# Altium project S7CAS-PLEIADES-CARTE-MERE_Pxx.PrjPcb (part 4 of 5)

## Sheet S7CAS-PLEIADES-CARTE-MERE_Pxx_ARBRE_ALIMENTATION.SchDoc
size Tabloid; SheetNumber: 15; SheetTotal: 18; Sheet_Name: Insert name in Document Parameters; Size: 11x17
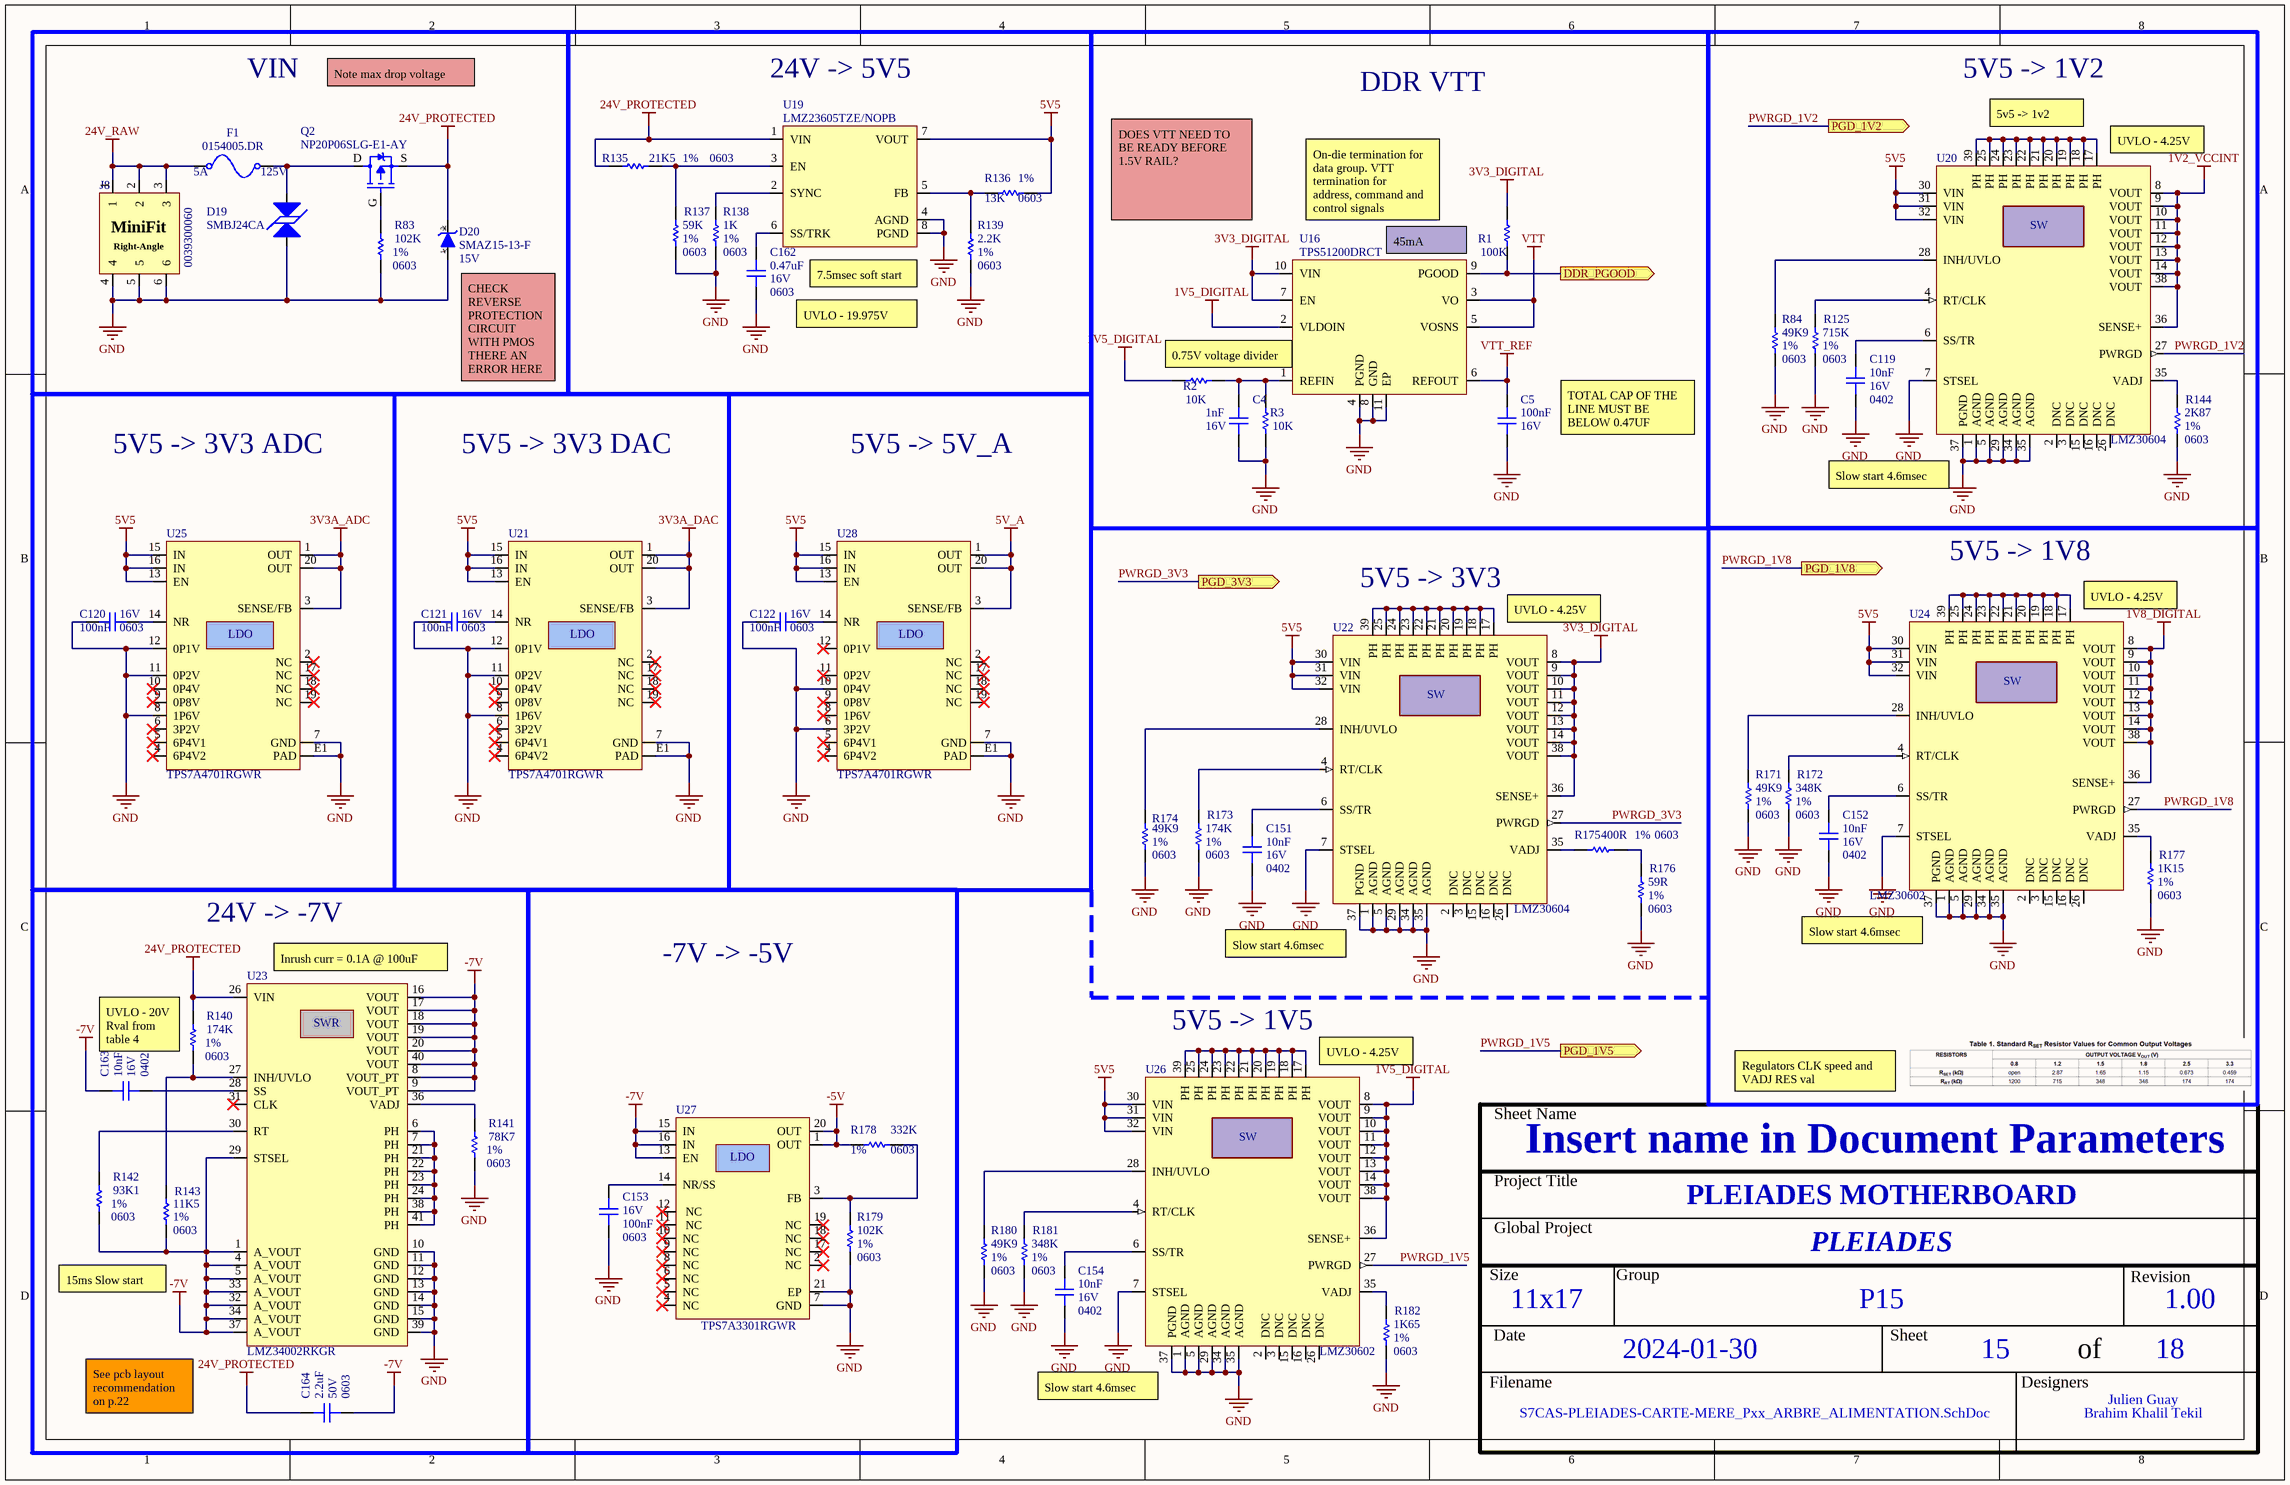
[diagram p13: S7CAS-PLEIADES-CARTE-MERE_Pxx_ARBRE_ALIMENTATION.SchDoc]

### Parts
C4  value 1nF  Voltage: 16V  [CAP_0603]  (hidden comment: CAP - 0603)
C5  value 100nF  Voltage: 16V  [CAP_0603]  (hidden comment: CAP - 0603)
C119  value 10nF  Voltage: 16V  Package: 0402  [CAP_0402]  (hidden comment: CAP - 0402)
C120  value 100nF  Voltage: 16V  Package: 0603  [CAP_0603]  (hidden comment: CAP - 0603)
C121  value 100nF  Voltage: 16V  Package: 0603  [CAP_0603]  (hidden comment: CAP - 0603)
C122  value 100nF  Voltage: 16V  Package: 0603  [CAP_0603]  (hidden comment: CAP - 0603)
C151  value 10nF  Voltage: 16V  Package: 0402  [CAP_0402]  (hidden comment: CAP - 0402)
C152  value 10nF  Voltage: 16V  Package: 0402  [CAP_0402]  (hidden comment: CAP - 0402)
C153  value 100nF  Voltage: 16V  Package: 0603  [CAP_0603]  (hidden comment: CAP - 0603)
C154  value 10nF  Voltage: 16V  Package: 0402  [CAP_0402]  (hidden comment: CAP - 0402)
C162  value 0.47uF  Voltage: 16V  Package: 0603  [CAP_0603]  (hidden comment: CAP - 0603)
C163  value 10nF  Voltage: 16V  Package: 0402  [CAP_0402]  (hidden comment: CAP - 0402)
C164  value 2.2uF  Voltage: 50V  Package: 0603  [CAP_0603]  (hidden comment: CAP - 0603)
D19  SMBJ24CA  [TVS_PWR_SMBJ36CA]
D20  SMAZ15-13-F  Reverse Voltage: 15V  [SMA]
F1  0154005.DR  Voltage Rating: 125V  Current Rating: 5A  [FUS_0154XXX.DR]
J8  0039300060  [CON_MINIFIT_0039300060]
Q2  NP20P06SLG-E1-AY  [TO-252]
R1  100K  [RES_0603]
R2  value 10K  [RES_0603]  (hidden comment: RES - 0603)
R3  value 10K  [RES_0603]  (hidden comment: RES - 0603)
R83  value 102K  Package: 0603  Precision: 1%  [RES_0603]  (hidden comment: RES - 0603)
R84  value 49K9  Package: 0603  Precision: 1%  [RES_0603]  (hidden comment: RES - 0603)
R125  value 715K  Package: 0603  Precision: 1%  [RES_0603]  (hidden comment: RES - 0603)
R135  value 21K5  Package: 0603  Precision: 1%  [RES_0603]  (hidden comment: RES - 0603)
R136  value 13K  Package: 0603  Precision: 1%  [RES_0603]  (hidden comment: RES - 0603)
R137  value 59K  Package: 0603  Precision: 1%  [RES_0603]  (hidden comment: RES - 0603)
R138  value 1K  Package: 0603  Precision: 1%  [RES_0603]  (hidden comment: RES - 0603)
R139  value 2.2K  Package: 0603  Precision: 1%  [RES_0603]  (hidden comment: RES - 0603)
R140  value 174K  Package: 0603  Precision: 1%  [RES_0603]  (hidden comment: RES - 0603)
R141  value 78K7  Package: 0603  Precision: 1%  [RES_0603]  (hidden comment: RES - 0603)
R142  value 93K1  Package: 0603  Precision: 1%  [RES_0603]  (hidden comment: RES - 0603)
R143  value 11K5  Package: 0603  Precision: 1%  [RES_0603]  (hidden comment: RES - 0603)
R144  value 2K87  Package: 0603  Precision: 1%  [RES_0603]  (hidden comment: RES - 0603)
R171  value 49K9  Package: 0603  Precision: 1%  [RES_0603]  (hidden comment: RES - 0603)
R172  value 348K  Package: 0603  Precision: 1%  [RES_0603]  (hidden comment: RES - 0603)
R173  value 174K  Package: 0603  Precision: 1%  [RES_0603]  (hidden comment: RES - 0603)
R174  value 49K9  Package: 0603  Precision: 1%  [RES_0603]  (hidden comment: RES - 0603)
R175  value 400R  Package: 0603  Precision: 1%  [RES_0603]  (hidden comment: RES - 0603)
R176  value 59R  Package: 0603  Precision: 1%  [RES_0603]  (hidden comment: RES - 0603)
R177  value 1K15  Package: 0603  Precision: 1%  [RES_0603]  (hidden comment: RES - 0603)
R178  value 332K  Package: 0603  Precision: 1%  [RES_0603]  (hidden comment: RES - 0603)
R179  value 102K  Package: 0603  Precision: 1%  [RES_0603]  (hidden comment: RES - 0603)
R180  value 49K9  Package: 0603  Precision: 1%  [RES_0603]  (hidden comment: RES - 0603)
R181  value 348K  Package: 0603  Precision: 1%  [RES_0603]  (hidden comment: RES - 0603)
R182  value 1K65  Package: 0603  Precision: 1%  [RES_0603]  (hidden comment: RES - 0603)
U16  TPS51200DRCT  [REG_PMIC_TPS51200DRCT]
U19  LMZ23605TZE/NOPB  [REG_SWR_LMZ23605TZE/NOPB]
U20  LMZ30604  [REG_SWI_LMZ30604]
U21  TPS7A4701RGWR  [REG_TPS7A4701RGWR]
U22  LMZ30604  [REG_SWI_LMZ30604]
U23  LMZ34002RKGR  [REG_SWR_LMZ34002RKGR]
U24  LMZ30602  [REG_SWI_LMZ30602]
U25  TPS7A4701RGWR  [REG_TPS7A4701RGWR]
U26  LMZ30602  [REG_SWI_LMZ30602]
U27  TPS7A3301RGWR  [REG_LDO_TPS7A3301RGWR]
U28  TPS7A4701RGWR  [REG_TPS7A4701RGWR]

### Blocks framed on the sheet
VIN: D19 D20 F1 J8 Q2 R83
24V -> 5V5: C162 R135-R139 U19
DDR VTT: C4 C5 R1-R3 U16
5V5 -> 1V2: C119 R84 R125 R144 U20
5V5 -> 3V3 DAC: C121 U21
5V5 -> 1V8: C152 R171 R172 R177 U24
24V -> -7V: C163 C164 R140-R143 U23
-7V -> -5V: C153 R178 R179 U27

### Ports
DDR_PGOOD (out), PGD_1V2 (out), PGD_1V5 (out), PGD_1V8 (out), PGD_3V3 (out)

### Nets
1V2_VCCINT: U20.8(VOUT) U20.9(VOUT) U20.10(VOUT) U20.11(VOUT) U20.12(VOUT) U20.13(VOUT) U20.14(VOUT) U20.36(SENSE+) U20.38(VOUT)
1V5_DIGITAL: R2.2 U16.2(VLDOIN) U26.8(VOUT) U26.9(VOUT) U26.10(VOUT) U26.11(VOUT) U26.12(VOUT) U26.13(VOUT) U26.14(VOUT) U26.36(SENSE+) U26.38(VOUT)
1V8_DIGITAL: U24.8(VOUT) U24.9(VOUT) U24.10(VOUT) U24.11(VOUT) U24.12(VOUT) U24.13(VOUT) U24.14(VOUT) U24.36(SENSE+) U24.38(VOUT)
3V3_DIGITAL: R1.1 U16.7(EN) U16.10(VIN) U22.8(VOUT) U22.9(VOUT) U22.10(VOUT) U22.11(VOUT) U22.12(VOUT) U22.13(VOUT) U22.14(VOUT) U22.36(SENSE+) U22.38(VOUT)
3V3A_ADC: U25.1(OUT) U25.3(SENSE/FB) U25.20(OUT)
3V3A_DAC: U21.1(OUT) U21.3(SENSE/FB) U21.20(OUT)
5V5: R136.1 U19.7(VOUT) U20.30(VIN) U20.31(VIN) U20.32(VIN) U21.13(EN) U21.15(IN) U21.16(IN) U22.30(VIN) U22.31(VIN) U22.32(VIN) U24.30(VIN) U24.31(VIN) U24.32(VIN) U25.13(EN) U25.15(IN) U25.16(IN) U26.30(VIN) U26.31(VIN) U26.32(VIN) U28.13(EN) U28.15(IN) U28.16(IN)
5V_A: U28.1(OUT) U28.3(SENSE/FB) U28.20(OUT)
24V_PROTECTED: C164.2 D20.2(K) Q2.S R135.2 R140.2 U19.1(VIN) U23.26(VIN)
24V_RAW: F1.1 J8.1 J8.2 J8.3
-5V: R178.2 U27.1(OUT) U27.20(OUT)
-7V: C163.2 C164.1 R142.1 R143.1 U23.1(A_VOUT) U23.4(A_VOUT) U23.5(A_VOUT) U23.8(VOUT_PT) U23.9(VOUT_PT) U23.16(VOUT) U23.17(VOUT) U23.18(VOUT) U23.19(VOUT) U23.20(VOUT) U23.29(STSEL) U23.32(A_VOUT) U23.33(A_VOUT) U23.34(A_VOUT) U23.37(A_VOUT) U23.40(VOUT) U27.13(EN) U27.15(IN) U27.16(IN)
GND: C4.1 C5.1 C119.1 C120.2 C121.2 C122.2 C151.1 C152.1 C153.2 C154.1 C162.1 D19.2 D20.1(A) J8.4 J8.5 J8.6 R3.1 R83.1 R84.1 R125.1 R137.1 R138.1 R139.1 R141.1 R144.1 R171.1 R172.1 R173.1 R174.1 R176.1 R177.1 R179.1 R180.1 R181.1 R182.1 U16.4(PGND) U16.8(GND) U16.11(EP) U19.4(AGND) U19.8(PGND) U20.1(AGND) U20.5(AGND) U20.7(STSEL) U20.29(AGND) U20.34(AGND) U20.35(AGND) U20.37(PGND) U21.7(GND) U21.8(1P6V) U21.11(0P2V) U21.12(0P1V) U21.E1(PAD) U22.1(AGND) U22.5(AGND) U22.7(STSEL) U22.29(AGND) U22.34(AGND) U22.35(AGND) U22.37(PGND) U23.10(GND) U23.11(GND) U23.12(GND) U23.13(GND) U23.14(GND) U23.15(GND) U23.39(GND) U24.1(AGND) U24.5(AGND) U24.7(STSEL) U24.29(AGND) U24.34(AGND) U24.35(AGND) U24.37(PGND) U25.7(GND) U25.8(1P6V) U25.11(0P2V) U25.12(0P1V) U25.E1(PAD) U26.1(AGND) U26.5(AGND) U26.7(STSEL) U26.29(AGND) U26.34(AGND) U26.35(AGND) U26.37(PGND) U27.7(GND) U27.21(EP) U28.6(3P2V) U28.7(GND) U28.10(0P4V) U28.E1(PAD)  [project net nCS]
VTT: U16.3(VO) U16.5(VOSNS)
VTT_REF: C5.2 U16.6(REFOUT)
DDR_PGOOD: R1.2 U16.9(PGOOD) ; port DDR_PGOOD
PWRGD_1V2: U20.27(PWRGD) ; port PGD_1V2
PWRGD_1V5: U26.27(PWRGD) ; port PGD_1V5
PWRGD_1V8: U24.27(PWRGD) ; port PGD_1V8
PWRGD_3V3: U22.27(PWRGD) ; port PGD_3V3
NetC4_2: C4.2 R2.1 R3.2 U16.1(REFIN)
NetC119_2: C119.2 U20.6(SS/TR)
NetC120_1: C120.1 U25.14(NR)
NetC121_1: C121.1 U21.14(NR)
NetC122_1: C122.1 U28.14(NR)
NetC151_2: C151.2 U22.6(SS/TR)
NetC152_2: C152.2 U24.6(SS/TR)
NetC153_1: C153.1 U27.14(NR/SS)
NetC154_2: C154.2 U26.6(SS/TR)
NetC162_2: C162.2 U19.6(SS/TRK)
NetC163_1: C163.1 U23.28(SS)
NetD19_1: D19.1 F1.2 Q2.D
NetQ2_G: Q2.G R83.2
NetR84_2: R84.2 U20.28(INH/UVLO)
NetR125_2: R125.2 U20.4(RT/CLK)
NetR135_1: R135.1 R137.2 U19.3(EN)
NetR136_2: R136.2 R139.2 U19.5(FB)
NetR138_2: R138.2 U19.2(SYNC)
NetR140_1: R140.1 R143.2 U23.27(INH/UVLO)
NetR141_2: R141.2 U23.36(VADJ)
NetR142_2: R142.2 U23.30(RT)
NetR144_2: R144.2 U20.35(VADJ)
NetR171_2: R171.2 U24.28(INH/UVLO)
NetR172_2: R172.2 U24.4(RT/CLK)
NetR173_2: R173.2 U22.4(RT/CLK)
NetR174_2: R174.2 U22.28(INH/UVLO)
NetR175_1: R175.1 R176.2
NetR175_2: R175.2 U22.35(VADJ)
NetR177_2: R177.2 U24.35(VADJ)
NetR178_1: R178.1 R179.2 U27.3(FB)
NetR180_2: R180.2 U26.28(INH/UVLO)
NetR181_2: R181.2 U26.4(RT/CLK)
NetR182_2: R182.2 U26.35(VADJ)
NetU20_17: U20.17(PH) U20.18(PH) U20.19(PH) U20.20(PH) U20.21(PH) U20.22(PH) U20.23(PH) U20.24(PH) U20.25(PH) U20.39(PH)
NetU22_17: U22.17(PH) U22.18(PH) U22.19(PH) U22.20(PH) U22.21(PH) U22.22(PH) U22.23(PH) U22.24(PH) U22.25(PH) U22.39(PH)
NetU23_6: U23.6(PH) U23.7(PH) U23.21(PH) U23.22(PH) U23.23(PH) U23.24(PH) U23.38(PH) U23.41(PH)
NetU24_17: U24.17(PH) U24.18(PH) U24.19(PH) U24.20(PH) U24.21(PH) U24.22(PH) U24.23(PH) U24.24(PH) U24.25(PH) U24.39(PH)
NetU26_17: U26.17(PH) U26.18(PH) U26.19(PH) U26.20(PH) U26.21(PH) U26.22(PH) U26.23(PH) U26.24(PH) U26.25(PH) U26.39(PH)

Not connected (* = marked no-connect by the designer): U20 2(DNC) 3(DNC) 15(DNC) 16(DNC) 26(DNC); U21 2(NC)* 4(6P4V2)* 5(6P4V1)* 6(3P2V)* 9(0P8V)* 10(0P4V)* 17(NC)* 18(NC)* 19(NC)*; U22 2(DNC) 3(DNC) 15(DNC) 16(DNC) 26(DNC); U23 2(DNC) 3(DNC) 25(DNC) 31(CLK)* 35(DNC); U24 2(DNC) 3(DNC) 15(DNC) 16(DNC) 26(DNC); U25 2(NC)* 4(6P4V2)* 5(6P4V1)* 6(3P2V)* 9(0P8V)* 10(0P4V)* 17(NC)* 18(NC)* 19(NC)*; U26 2(DNC) 3(DNC) 15(DNC) 16(DNC) 26(DNC); U27 2(NC)* 4(NC)* 5(NC)* 6(NC)* 8(NC)* 9(NC)* 10(NC)* 11(NC)* 12(NC)* 17(NC)* 18(NC)* 19(NC)*; U28 2(NC)* 4(6P4V2)* 5(6P4V1)* 8(1P6V)* 9(0P8V)* 11(0P2V)* 12(0P1V)* 17(NC)* 18(NC)* 19(NC)*

### Notes on the sheet
- Note max drop voltage
- (near U20) 5v5 -> 1v2
- (near U20) UVLO - 4.25V
- DOES VTT NEED TO BE READY BEFORE 1.5V RAIL?
- On-die termination for data group. VTT termination for
  address, command and control signals
- (near U19) 7.5msec soft start
- (near U16) 45mA
- UVLO - 19.975V
- (near U16) 0.75V voltage divider
- (near D20) CHECK REVERSE PROTECTION CIRCUIT WITH PMOS
  THERE AN ERROR HERE
- TOTAL CAP OF THE LINE MUST BE BELOW 0.47UF
- 5V5 -> 3V3 ADC
- 5V5 -> 5V_A
- (near U20) Slow start 4.6msec
- (near U22) 5V5 -> 3V3
- (near U22) UVLO - 4.25V
- (near U24) UVLO - 4.25V
- (near U23) Inrush curr = 0.1A @ 100uF
- (near U22) Slow start 4.6msec
- (near U24) Slow start 4.6msec
- (near U26) 5V5 -> 1V5
- (near R140) UVLO - 20V
  Rval from
  table 4
- (near U26) UVLO - 4.25V
- Regulators CLK speed and
  VADJ RES val
- 15ms Slow start
- See pcb layout recommendation on p.22
- (near U26) Slow start 4.6msec
- Sheet Name
- Project Title
- Global Project
- Size
- Group
- Revision
- Date
- Sheet
- of
- Filename
- Designers
- (in symbol CON_MINIFIT_0039300060) MiniFit; Right-Angle
- (in symbol REG_LDO_TPS7A3301RGWR) LDO
- (in symbol REG_LDO_TPS7A4701RGWR) LDO
- (in symbol REG_SWR_LMZ30602) SW
- (in symbol REG_SWR_LMZ30604) SW
- (in symbol REG_SWR_LMZ34002RKGR) SWR

### Library data of the parts
C4 C5 C120-C122 C153 C162 C164 = CAP - 0603: Precision: 10%; Current: *; CreatedBy: Jonathan Bouchard; Power: *
  C4: Package: 0603; Supplier 1: Mouser; Supplier Part Number 1: 80-C0603C102K4R
  C5: Package: 0603; Supplier 1: Arrow Electronics; Supplier Part Number 1: CL10B104KO8NNNC
  C120-C122 C153: Supplier 1: Arrow Electronics; Supplier Part Number 1: CL10B104KO8NNNC
  C162: Supplier 1: Arrow Electronics; Supplier Part Number 1: C1608X7R1C474K080AC
  C164: Supplier 1: Arrow Electronics; Supplier Part Number 1: GRM188R61H225KE11D
C119 C151 C152 C154 C163 = CAP - 0402: Precision: 10%; Current: *; CreatedBy: Jonathan Bouchard; Power: *; Supplier 1: Arrow Electronics; Supplier Part Number 1: GRM155R61A224KE19D
D19 = TVS_PWR_SMBJ24CA: TVS - 24V 26.7V 600W - DO214AA; Manufacturer #1: Littelfuse Inc.; Value: Vbr = 26.7V -  Clamp = 38.9V; Voltage Rating: 24V Standoff; Current Rating: 15.5A; GRAMS Lib Spec: 2.8; Magnetic Material: UNKNOWN; Polarized: NO; Tolerance: *; Power Max: 600W; HelpURL: http://www.littelfuse.com/~/media/electronics/datasheets/tvs_diodes/littelfuse_tvs_diode_smbj_datasheet.pdf.pdf; CreatedBy/Date: Arnaud Samson - 06/07/18; VerifiedBy: Jonathan Bouchard - 2018-07-13; Temperature: -65°C ~ 150°C (TJ); Package: DO214AA; Manufacturer #2: *; Note: *; Assembly Type: SMD; Part Number #2: *; Part Number #1: SMBJ24CA; Supplier 1: Digi-Key; Supplier Part Number 1: SMBJ24CALFCT-ND; Cryo: UNKNOWN
D20 = ZENER - SMAZ15-13-F: ZENER - Zener Diode 15 V 1 W ±5% Surface Mount SMA; Diode Type: *; Current: *; Package / Case: *; Forward Voltage: *; Supplier 1: Future Electronics; Supplier Part Number 1: 2124428
F1 = FUS_0154005.DR: FUS - 5 A 125 VAC/VDC - 2-SMD; Manufacturer #1: Littelfuse Inc.; Value: 5A 125V AC/DC FAST; GRAMS Lib Spec: 2.8; Magnetic Material: UNKNOWN; Polarized: NO; Tolerance: *; Power Max: *; HelpURL: http://www.littelfuse.com/~/media/electronics/datasheets/fuses/littelfuse_fuse_154_154t_154l_154tl_datasheet.pdf.pdf; CreatedBy/Date: Arnaud Samson - 06/07/18; VerifiedBy: Jonathan Bouchard 2018-07-16; Temperature: -55°C ~ 125°C; Package: 2-SMD; Manufacturer #2: *; Note: *; Assembly Type: SMD; Part Number #2: *; Part Number #1: 0154005.DR; Supplier 1: Digi-Key; Supplier Part Number 1: F1228CT-ND; Cryo: UNKNOWN
J8 = CON_MINIFIT_0039300060: CON - Mini-Fit Through Hole, Right Angle 6 position; Manufacturer #1: Molex; Current Rating: 8A; GRAMS Lib Spec: 2.8; Magnetic Material: Unknown; Polarized: Yes; Voltage Rating: 600V; Assembly Type: TH; CreatedBy/Date: Joel Lemay 2018-06-21; HelpURL: https://www.molex.com/pdm_docs/sd/039300060_sd.pdf; Manufacturer #2: *; Package: TH; Part Number #1: 0039300060; Part Number #2: *; Power Max: *; Supplier 1: Digi-Key; Supplier Part Number 1: WM21353-ND; Temperature: - 40°C to + 80°C; Tolerance: *; Value: *; VerifiedBy: Caroline Paulin - 10 sept 2018; Cryo: UNKNOWN
Q2 = MOS_P_CHANNEL: P-Channel  Enhancement Mode Field Effect Transistor; Current: [Current]; Mfr: *; Package / Case: *; Vds: *; Rds ON: *; Vgs: *; Operating Temperature: *; Supplier 1: Mouser; Supplier Part Number 1: 584-ADP5034ACPZ-R2
R1-R3 = RES - 0603: Precision: 1%; Current: *; CreatedBy: Jonathan Bouchard; Package: 0603; Supplier 1: Arrow Electronics
  R1: Value: 100K; Supplier Part Number 1: RMCF0603FT100K
  R2 R3: Supplier Part Number 1: RMCF0603FT10K0
U16 = REG_PMIC_TPS51200DRCT: REG - DDR TERMINATION/REF REG - 10-VFDFN; Manufacturer #1: Texas Instruments; Value: DDR, DDR2, DDR3(L), DDR4; Voltage Rating: 2.375V ~ 3.5V; Current Rating: Source: 3A~4.5A, Sink: 3.5A~5.5A; GRAMS Lib Spec: 2.8; Magnetic Material: Unknown; Polarized: Yes; Tolerance: *; Power Max: *; HelpURL: http://www.ti.com/lit/ds/symlink/tps51200.pdf; CreatedBy/Date: Joel Lemay 2019-03-19; VerifiedBy: Nicolas V. (2019-05-31); Temperature: -40°C ~ 85°C; Package: 10-VFDFN; Manufacturer #2: *; Note: *; Assembly Type: SMD; Part Number #2: *; Part Number #1: TPS51200DRCT; Supplier 1: Digi-Key; Supplier Part Number 1: 296-23830-1-ND; Cryo: UNKNOWN
U19 = REG_SWR_LMZ23605TZE/NOPB: REG - IC BUCK SYNC 36V 5A - TO-PMOD-7; Manufacturer #1: Texas Instruments; Value: 0.8 ~ 6 V; Voltage Rating: 6 ~ 36 V; GRAMS Lib Spec: 2.8; Note: One Reflow; Magnetic Material: YES; Cryo: UNKNOWN; Tolerance: *; Current Rating: 5A; Power Max: *; HelpURL: http://www.ti.com/lit/ds/symlink/lmz23605.pdf; CreatedBy/Date: Arnaud Samson - 05/07/18; VerifiedBy: Jonathan Bouchard 2018-07-13; Temperature: -40°C ~ 125°C; Package: TO-PMOD-7; Manufacturer #2: *; Assembly Type: SMD; Part Number #2: *; Part Number #1: LMZ23605TZE/NOPB; Polarized: YES; Supplier 1: Digi-Key; Supplier Part Number 1: 296-35357-1-ND
U20 U22 = REG_SWR_LMZ30604: REG SWR - Non-Isolated PoL Module DC DC Converter 1 Output 0.8 ~ 3.6V 4A 2.95V - 6V Input; GRAMS Lib Spec: 2.7; Supplier 1: Mouser; Supplier Part Number 1: 595-LMZ30604RKGR
U21 U25 U28 = REG_LDO_TPS7A4701RGWR: REG - LINEAR POS ADJ 1A - 20VQFN; Manufacturer #1: Texas Instruments; GRAMS Lib Spec: 2.8; Magnetic Material: Unknown; Polarized: Yes; Value: 1.4 à 34V; Voltage rating: 35V max; Assembly Type: SMD; CreatedBy/Date: L-P Gauthier / 2018-05-29; Current Rating: 1A; Manufacturer #2: TBD; Part Number #1: TPS7A4701RGWR; Part Number #2: TBD; Package: 20-VQFN Exposed Pad; Power Max: *; Tolerance: -; Supplier 1: Digi-Key; Supplier Part Number 1: 296-37224-1-ND; VerifiedBy: Caroline Paulin - 28 sept 2018; Temperature: -40°C ~ 125°C; HelpURL: http://www.ti.com/lit/ds/symlink/tps7a47.pdf; Cryo: UNKNOWN
U23 = REG_SWR_LMZ34002RKGR: REG - DC DC Converter -3V to -17V 2A - 41-B1QFN; Manufacturer #1: Texas Instruments; Value: -3 ~ -17V; Voltage Rating: 4.5-40V; Power Max: 15W; GRAMS Lib Spec: 2.8c; Magnetic Material: Unknown; Polarized: Yes; Assembly Note: One reflow only; Tolerance: *; Current Rating: 2A; HelpURL: http://www.ti.com/lit/ds/symlink/lmz34002.pdf; CreatedBy/Date: P.Marcoux  20-06-2019; VerifiedBy: C.Paulin - 22/01/2020; Temperature: -40°C ~ 85°C; Package: 41-B1QFN; Manufacturer #2: *; Note: *; Assembly Type: SMD; Part Number #2: *; Part Number #1: LMZ34002RKGR; Supplier 1: Digi-Key; Supplier Part Number 1: 296-44356-1-ND; Cryo: UNKNOWN
U24 U26 = REG_SWR_LMZ30602: REG SWR - Non-Isolated PoL Module DC DC Converter 1 Output 0.8 ~ 3.6V 2A 2.95V - 6V Input; GRAMS Lib Spec: 2.7; Supplier 1: Mouser; Supplier Part Number 1: 595-LMZ30602RKGT
U27 = REG_LDO_TPS7A3301RGWR: REG - LDO Negative Adjustable 1 Output -1.18V-33V 1A -  20-VQFN (5x5); Manufacturer #1: Texas Instruments; Value: -1.18V~-33V; Voltage Rating: -36V; GRAMS Lib Spec: 2.8; Magnetic Material: Unknown; Polarized: Yes; Tolerance: *; Current Rating: 1A; Power Max: *; HelpURL: http://www.ti.com/lit/ds/symlink/tps7a33.pdf; CreatedBy/Date: Keven Deslandes - 2018/10/11; VerifiedBy: Caroline Paulin - 11/12/2018; Temperature: -40°C ~ 125°C; Package: 20-VQFN; Manufacturer #2: *; Assembly Type: SMD; Part Number #2: *; Part Number #1: TPS7A3301RGWR; Supplier 1: Digi-Key; Supplier Part Number 1: 296-39502-1-ND; Cryo: UNKNOWN
R83 R84 R125 R135-R144 R171-R182 = RES - 0603: Current: *; CreatedBy: Jonathan Bouchard
  R83 R179: Supplier 1: Arrow Electronics; Supplier Part Number 1: RMCF0603FT102K
  R84 R171 R174 R180: Supplier 1: Digikey; Supplier Part Number 1: RMCF0603FG49K9CT-ND
  R125: Supplier 1: Digikey; Supplier Part Number 1: 738-RMCF0603FT715KCT-ND
  R135: Supplier 1: Arrow Electronics; Supplier Part Number 1: RMCF0603FT21K5
  R136: Supplier 1: Arrow Electronics; Supplier Part Number 1: RMCF0603FT13K0
  R137: Supplier 1: Arrow Electronics; Supplier Part Number 1: RMCF0603FT59K0
  R138: Supplier 1: Arrow Electronics; Supplier Part Number 1: RMCF0603FT1K00
  R139: Supplier 1: Newark; Supplier Part Number 1: 94X1502
  R140 R173: Supplier 1: Arrow Electronics; Supplier Part Number 1: RMCF0603FT174K
  R141: Supplier 1: Arrow Electronics; Supplier Part Number 1: RMCF0603FT78K7
  R142: Supplier 1: Arrow Electronics; Supplier Part Number 1: RMCF0603FT93K1
  R143: Supplier 1: Arrow Electronics; Supplier Part Number 1: RMCF0603FT11K5
  R144: Supplier 1: Arrow Electronics; Supplier Part Number 1: RMCF0603FT2K87
  R172 R181: Supplier 1: Arrow Electronics; Supplier Part Number 1: RMCF0603FT348K
  R175: Supplier 1: Mouser; Supplier Part Number 1: 71-PAT0603E4000BST1
  R176: Supplier 1: Digikey; Supplier Part Number 1: 738-RMCF0603FT59R0CT-ND
  R177: Supplier 1: Arrow Electronics; Supplier Part Number 1: RMCF0603FT1K15
  R178: Supplier 1: Arrow Electronics; Supplier Part Number 1: RMCF0603FT332K
  R182: Supplier 1: Arrow Electronics; Supplier Part Number 1: RMCF0603FT1K65

## Sheet S7CAS-PLEIADES-CARTE-MERE_Pxx_ARBRE_CAP_ARBRE.SchDoc
size Tabloid; SheetNumber: 16; SheetTotal: 18; Sheet_Name: POWER TREE DECOUPLING; Size: 11x17
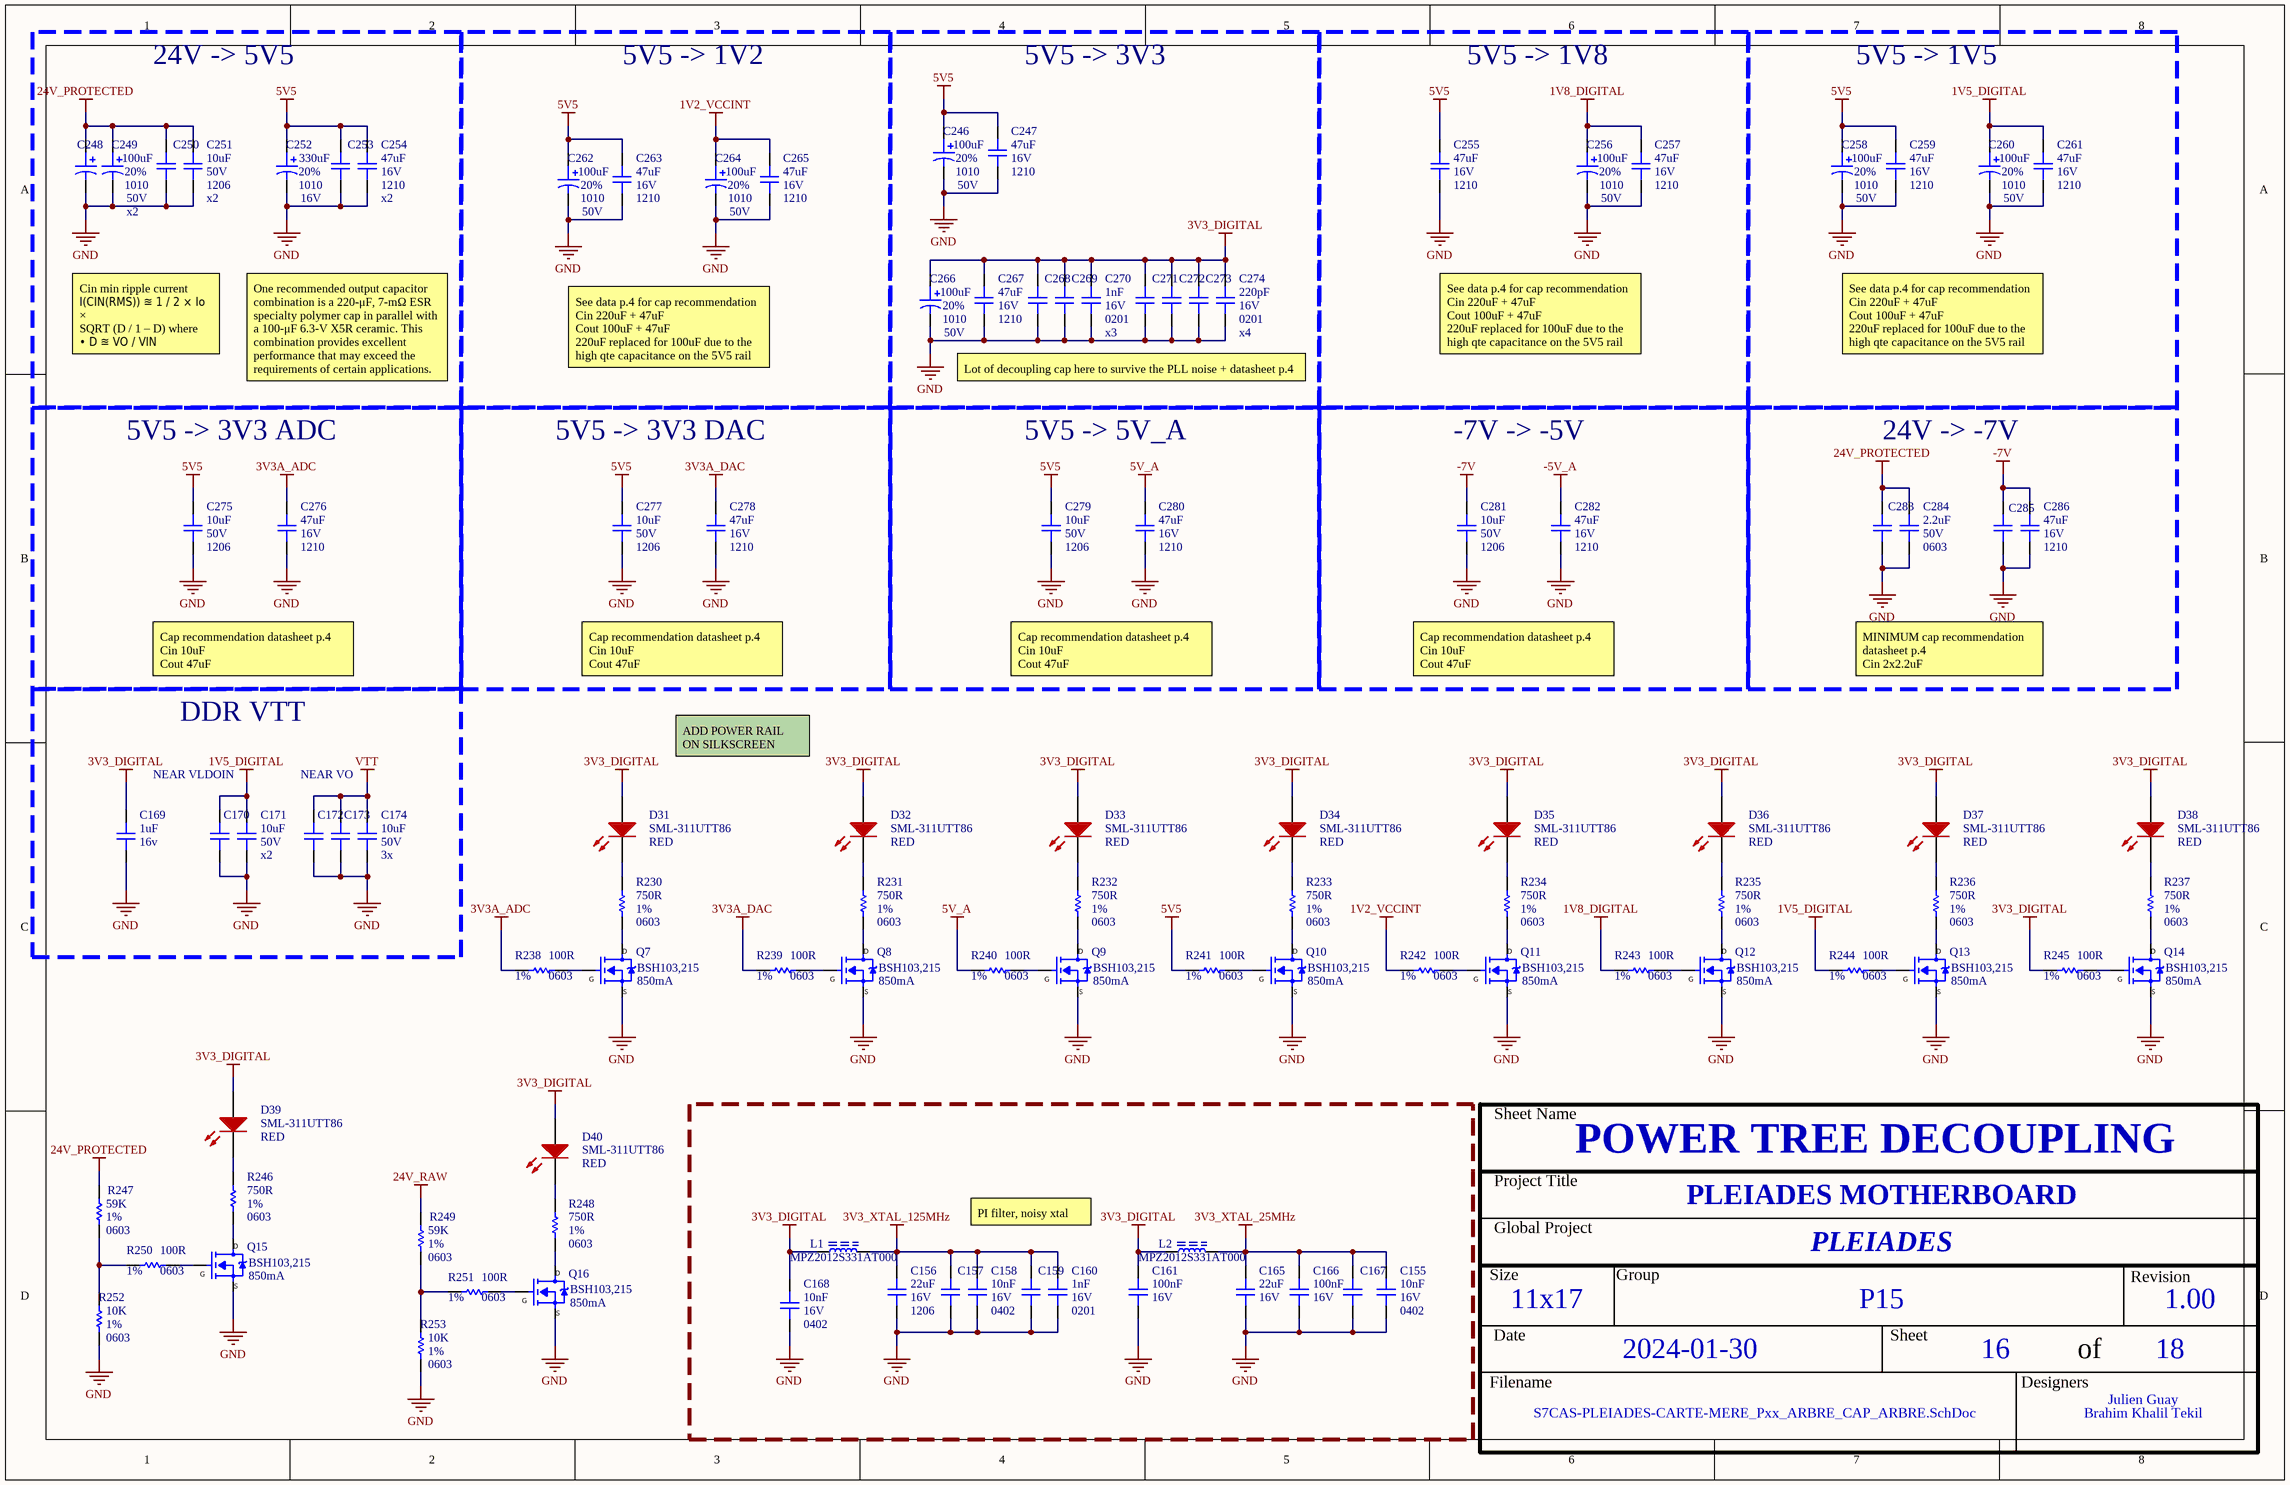
[diagram p14: S7CAS-PLEIADES-CARTE-MERE_Pxx_ARBRE_CAP_ARBRE.SchDoc]

### Parts
C155  value 10nF  Voltage: 16V  Package: 0402  [CAP_0402]  (hidden comment: CAP - 0402)
C156  value 22uF  Voltage: 16V  Package: 1206  [CAP_1206]  (hidden comment: CAP - 1206)
C157  CAP - 0402  [CAP_0402]  (value not drawn)
C158  value 10nF  Voltage: 16V  Package: 0402  [CAP_0402]  (hidden comment: CAP - 0402)
C159  CAP - 0201  [CAP_0201]  (value not drawn)
C160  value 1nF  Voltage: 16V  Package: 0201  [CAP_0201]  (hidden comment: CAP - 0201)
C161  value 100nF  Voltage: 16V  [CAP_0603]  (hidden comment: CAP - 0603)
C165  value 22uF  Voltage: 16V  [CAP_1206]  (hidden comment: CAP - 1206)
C166  value 100nF  Voltage: 16V  [CAP_0603]  (hidden comment: CAP - 0603)
C167  CAP - 0402  [CAP_0402]  (value not drawn)
C168  value 10nF  Voltage: 16V  Package: 0402  [CAP_0402]  (hidden comment: CAP - 0402)
C169  value 1uF  Voltage: 16v  [CAP_0603]  (hidden comment: CAP - 0603)
C170  CAP - 0805  [CAP_0805]  (value not drawn)
C171  value 10uF  Voltage: 50V  [CAP_0805]  (hidden comment: CAP - 0805)
C172  CAP - 0805  [CAP_0805]  (value not drawn)
C173  CAP - 0805  [CAP_0805]  (value not drawn)
C174  value 10uF  Voltage: 50V  [CAP_0805]  (hidden comment: CAP - 0805)
C246  value 100uF  Voltage: 50V  Package: 1010  Precision: 20%  [CAP_ALU_1010_vishay]  (hidden comment: MAL215099101E3)
C247  value 47uF  Voltage: 16V  Package: 1210  [CAP_1210]  (hidden comment: CAP - 1210)
C248  MAL215099101E3  [CAP_ALU_1010_vishay]  (value not drawn)
C249  value 100uF  Voltage: 50V  Package: 1010  Precision: 20%  [CAP_ALU_1010_vishay]  (hidden comment: MAL215099101E3)
C250  CAP - 1206  [CAP_1206]  (value not drawn)
C251  value 10uF  Voltage: 50V  Package: 1206  [CAP_1206]  (hidden comment: CAP - 1206)
C252  value 330uF  Voltage: 16V  Package: 1010  Precision: 20%  [CAP_ALU_1010_vishay]  (hidden comment: MAL214699501E3)
C253  CAP - 1210  [CAP_1210]  (value not drawn)
C254  value 47uF  Voltage: 16V  Package: 1210  [CAP_1210]  (hidden comment: CAP - 1210)
C255  value 47uF  Voltage: 16V  Package: 1210  [CAP_1210]  (hidden comment: CAP - 1210)
C256  value 100uF  Voltage: 50V  Package: 1010  Precision: 20%  [CAP_ALU_1010_vishay]  (hidden comment: MAL215099101E3)
C257  value 47uF  Voltage: 16V  Package: 1210  [CAP_1210]  (hidden comment: CAP - 1210)
C258  value 100uF  Voltage: 50V  Package: 1010  Precision: 20%  [CAP_ALU_1010_vishay]  (hidden comment: MAL215099101E3)
C259  value 47uF  Voltage: 16V  Package: 1210  [CAP_1210]  (hidden comment: CAP - 1210)
C260  value 100uF  Voltage: 50V  Package: 1010  Precision: 20%  [CAP_ALU_1010_vishay]  (hidden comment: MAL215099101E3)
C261  value 47uF  Voltage: 16V  Package: 1210  [CAP_1210]  (hidden comment: CAP - 1210)
C262  value 100uF  Voltage: 50V  Package: 1010  Precision: 20%  [CAP_ALU_1010_vishay]  (hidden comment: MAL215099101E3)
C263  value 47uF  Voltage: 16V  Package: 1210  [CAP_1210]  (hidden comment: CAP - 1210)
C264  value 100uF  Voltage: 50V  Package: 1010  Precision: 20%  [CAP_ALU_1010_vishay]  (hidden comment: MAL215099101E3)
C265  value 47uF  Voltage: 16V  Package: 1210  [CAP_1210]  (hidden comment: CAP - 1210)
C266  value 100uF  Voltage: 50V  Package: 1010  Precision: 20%  [CAP_ALU_1010_vishay]  (hidden comment: MAL215099101E3)
C267  value 47uF  Voltage: 16V  Package: 1210  [CAP_1210]  (hidden comment: CAP - 1210)
C268  CAP - 0201  [CAP_0201]  (value not drawn)
C269  CAP - 0201  [CAP_0201]  (value not drawn)
C270  value 1nF  Voltage: 16V  Package: 0201  [CAP_0201]  (hidden comment: CAP - 0201)
C271  CAP - 0201  [CAP_0201]  (value not drawn)
C272  CAP - 0201  [CAP_0201]  (value not drawn)
C273  CAP - 0201  [CAP_0201]  (value not drawn)
C274  value 220pF  Voltage: 16V  Package: 0201  [CAP_0201]  (hidden comment: CAP - 0201)
C275  value 10uF  Voltage: 50V  Package: 1206  [CAP_1206]  (hidden comment: CAP - 1206)
C276  value 47uF  Voltage: 16V  Package: 1210  [CAP_1210]  (hidden comment: CAP - 1210)
C277  value 10uF  Voltage: 50V  Package: 1206  [CAP_1206]  (hidden comment: CAP - 1206)
C278  value 47uF  Voltage: 16V  Package: 1210  [CAP_1210]  (hidden comment: CAP - 1210)
C279  value 10uF  Voltage: 50V  Package: 1206  [CAP_1206]  (hidden comment: CAP - 1206)
C280  value 47uF  Voltage: 16V  Package: 1210  [CAP_1210]  (hidden comment: CAP - 1210)
C281  value 10uF  Voltage: 50V  Package: 1206  [CAP_1206]  (hidden comment: CAP - 1206)
C282  value 47uF  Voltage: 16V  Package: 1210  [CAP_1210]  (hidden comment: CAP - 1210)
C283  CAP - 0603  [CAP_0603]  (value not drawn)
C284  value 2.2uF  Voltage: 50V  Package: 0603  [CAP_0603]  (hidden comment: CAP - 0603)
C285  CAP - 1210  [CAP_1210]  (value not drawn)
C286  value 47uF  Voltage: 16V  Package: 1210  [CAP_1210]  (hidden comment: CAP - 1210)
D31  SML-311UTT86  value RED  [LED_0603]
D32  SML-311UTT86  value RED  [LED_0603]
D33  SML-311UTT86  value RED  [LED_0603]
D34  SML-311UTT86  value RED  [LED_0603]
D35  SML-311UTT86  value RED  [LED_0603]
D36  SML-311UTT86  value RED  [LED_0603]
D37  SML-311UTT86  value RED  [LED_0603]
D38  SML-311UTT86  value RED  [LED_0603]
D39  SML-311UTT86  value RED  [LED_0603]
D40  SML-311UTT86  value RED  [LED_0603]
L1  Mfg Part Number: MPZ2012S331AT000  [FER_0805]  (hidden comment: FER - 0805)
L2  Mfg Part Number: MPZ2012S331AT000  [FER_0805]  (hidden comment: FER - 0805)
Q7  BSH103,215  Current: 850mA  [SOT23-3]
Q8  BSH103,215  Current: 850mA  [SOT23-3]
Q9  BSH103,215  Current: 850mA  [SOT23-3]
Q10  BSH103,215  Current: 850mA  [SOT23-3]
Q11  BSH103,215  Current: 850mA  [SOT23-3]
Q12  BSH103,215  Current: 850mA  [SOT23-3]
Q13  BSH103,215  Current: 850mA  [SOT23-3]
Q14  BSH103,215  Current: 850mA  [SOT23-3]
Q15  BSH103,215  Current: 850mA  [SOT23-3]
Q16  BSH103,215  Current: 850mA  [SOT23-3]
R230  value 750R  Package: 0603  Precision: 1%  [RES_0603]  (hidden comment: RES - 0603)
R231  value 750R  Package: 0603  Precision: 1%  [RES_0603]  (hidden comment: RES - 0603)
R232  value 750R  Package: 0603  Precision: 1%  [RES_0603]  (hidden comment: RES - 0603)
R233  value 750R  Package: 0603  Precision: 1%  [RES_0603]  (hidden comment: RES - 0603)
R234  value 750R  Package: 0603  Precision: 1%  [RES_0603]  (hidden comment: RES - 0603)
R235  value 750R  Package: 0603  Precision: 1%  [RES_0603]  (hidden comment: RES - 0603)
R236  value 750R  Package: 0603  Precision: 1%  [RES_0603]  (hidden comment: RES - 0603)
R237  value 750R  Package: 0603  Precision: 1%  [RES_0603]  (hidden comment: RES - 0603)
R238  value 100R  Package: 0603  Precision: 1%  [RES_0603]  (hidden comment: RES - 0603)
R239  value 100R  Package: 0603  Precision: 1%  [RES_0603]  (hidden comment: RES - 0603)
R240  value 100R  Package: 0603  Precision: 1%  [RES_0603]  (hidden comment: RES - 0603)
R241  value 100R  Package: 0603  Precision: 1%  [RES_0603]  (hidden comment: RES - 0603)
R242  value 100R  Package: 0603  Precision: 1%  [RES_0603]  (hidden comment: RES - 0603)
R243  value 100R  Package: 0603  Precision: 1%  [RES_0603]  (hidden comment: RES - 0603)
R244  value 100R  Package: 0603  Precision: 1%  [RES_0603]  (hidden comment: RES - 0603)
R245  value 100R  Package: 0603  Precision: 1%  [RES_0603]  (hidden comment: RES - 0603)
R246  value 750R  Package: 0603  Precision: 1%  [RES_0603]  (hidden comment: RES - 0603)
R247  value 59K  Package: 0603  Precision: 1%  [RES_0603]  (hidden comment: RES - 0603)
R248  value 750R  Package: 0603  Precision: 1%  [RES_0603]  (hidden comment: RES - 0603)
R249  value 59K  Package: 0603  Precision: 1%  [RES_0603]  (hidden comment: RES - 0603)
R250  value 100R  Package: 0603  Precision: 1%  [RES_0603]  (hidden comment: RES - 0603)
R251  value 100R  Package: 0603  Precision: 1%  [RES_0603]  (hidden comment: RES - 0603)
R252  value 10K  Package: 0603  Precision: 1%  [RES_0603]  (hidden comment: RES - 0603)
R253  value 10K  Package: 0603  Precision: 1%  [RES_0603]  (hidden comment: RES - 0603)

### Blocks framed on the sheet
24V -> 5V5: C248-C254
5V5 -> 1V2: C262-C265
5V5 -> 3V3: C246 C247 C266-C274
5V5 -> 1V8: C255-C257
5V5 -> 1V5: C258-C261
5V5 -> 3V3 ADC: C275 C276
5V5 -> 3V3 DAC: C277 C278
5V5 -> 5V_A: C279 C280
-7V -> -5V: C281 C282
24V -> -7V: C283-C286
DDR VTT: C169-C174

### Nets
1V2_VCCINT: C264.1 C265.2 R242.2
1V5_DIGITAL: C170.2 C171.2 C260.1 C261.2 R244.2
1V8_DIGITAL: C256.1 C257.2 R243.2
3V3_DIGITAL: C161.2 C168.2 C169.2 C266.1 C267.2 C268.2 C269.2 C270.2 C271.2 C272.2 C273.2 C274.2 D31.A D32.A D33.A D34.A D35.A D36.A D37.A D38.A D39.A D40.A L1.2 L2.2 R245.2
3V3_XTAL_25MHz: C155.2 C165.2 C166.2 C167.2 L2.1
3V3_XTAL_125MHz: C156.2 C157.2 C158.2 C159.2 C160.2 L1.1
3V3A_ADC: C276.2 R238.2
3V3A_DAC: C278.2 R239.2
5V5: C246.1 C247.2 C252.1 C253.2 C254.2 C255.2 C258.1 C259.2 C262.1 C263.2 C275.2 C277.2 C279.2 R241.2
5V_A: C280.2 R240.2
24V_PROTECTED: C248.1 C249.1 C250.2 C251.2 C283.2 C284.2 R247.2
24V_RAW: R249.2
-5V_A: C282.2
-7V: C281.2 C285.2 C286.2
GND: C155.1 C156.1 C157.1 C158.1 C159.1 C160.1 C161.1 C165.1 C166.1 C167.1 C168.1 C169.1 C170.1 C171.1 C172.1 C173.1 C174.1 C246.2 C247.1 C248.2 C249.2 C250.1 C251.1 C252.2 C253.1 C254.1 C255.1 C256.2 C257.1 C258.2 C259.1 C260.2 C261.1 C262.2 C263.1 C264.2 C265.1 C266.2 C267.1 C268.1 C269.1 C270.1 C271.1 C272.1 C273.1 C274.1 C275.1 C276.1 C277.1 C278.1 C279.1 C280.1 C281.1 C282.1 C283.1 C284.1 C285.1 C286.1 Q7.2 Q8.2 Q9.2 Q10.2 Q11.2 Q12.2 Q13.2 Q14.2 Q15.2 Q16.2 R252.1 R253.1  [project net nCS]
VTT: C172.2 C173.2 C174.2
NetD31_K: D31.K R230.2
NetD32_K: D32.K R231.2
NetD33_K: D33.K R232.2
NetD34_K: D34.K R233.2
NetD35_K: D35.K R234.2
NetD36_K: D36.K R235.2
NetD37_K: D37.K R236.2
NetD38_K: D38.K R237.2
NetD39_K: D39.K R246.2
NetD40_K: D40.K R248.2
NetQ7_1: Q7.1 R238.1
NetQ7_3: Q7.3 R230.1
NetQ8_1: Q8.1 R239.1
NetQ8_3: Q8.3 R231.1
NetQ9_1: Q9.1 R240.1
NetQ9_3: Q9.3 R232.1
NetQ10_1: Q10.1 R241.1
NetQ10_3: Q10.3 R233.1
NetQ11_1: Q11.1 R242.1
NetQ11_3: Q11.3 R234.1
NetQ12_1: Q12.1 R243.1
NetQ12_3: Q12.3 R235.1
NetQ13_1: Q13.1 R244.1
NetQ13_3: Q13.3 R236.1
NetQ14_1: Q14.1 R245.1
NetQ14_3: Q14.3 R237.1
NetQ15_1: Q15.1 R250.1
NetQ15_3: Q15.3 R246.1
NetQ16_1: Q16.1 R251.1
NetQ16_3: Q16.3 R248.1
NetR247_1: R247.1 R250.2 R252.2
NetR249_1: R249.1 R251.2 R253.2

### Notes on the sheet
- x2
- (near C251) x2
- (near C254) x2
- Cin min ripple current
  I(CIN(RMS)) ≊ 1 / 2 × Io ×
  SQRT (D / 1 – D) where
  • D ≊ VO / VIN
  Iripple = 0.55A
- See data p.4 for cap recommendation
  Cin 220uF + 47uF
  Cout 100uF + 47uF
  220uF replaced for 100uF due to the high qte capacitance on the 5V5 rail
- x3
- (near C274) x4
- One recommended output capacitor combination is a 220-μF, 7-mΩ ESR specialty polymer cap in parallel with a 100-μF 6.3-V X5R ceramic. This combination provides excellent performance that may exceed the requirements of certain applications.
- Lot of decoupling cap here to survive the PLL noise + datasheet p.4
- Cap recommendation datasheet p.4
  Cin 10uF
  Cout 47uF
- MINIMUM cap recommendation datasheet p.4
  Cin 2x2.2uF
  Cout 2x47uF
- ADD POWER RAIL
  ON SILKSCREEN
- NEAR VLDOIN
- NEAR VO
- (near C171) x2
- (near C174) 3x
- PI filter, noisy xtal
- Sheet Name
- Project Title
- Global Project
- Size
- Group
- Revision
- Date
- Sheet
- of
- Filename
- Designers
- (in symbol MOS_N_CHANNEL) D; G; S

### Library data of the parts
C155 C158 C168 = CAP - 0402: Precision: 10%; Current: *; CreatedBy: Jonathan Bouchard; Power: *; Supplier 1: Arrow Electronics; Supplier Part Number 1: GRM155R61A224KE19D
C156 C165 C251 C275 C277 C279 C281 = CAP - 1206: Precision: 10%; Current: *; CreatedBy: Jonathan Bouchard; Power: *
  C156: Supplier 1: Arrow Electronics; Supplier Part Number 1: CL31A226MOCLNNC
  C165: Package: 1206; Supplier 1: Arrow Electronics; Supplier Part Number 1: CL31A226MOCLNNC
  C251 C275 C277 C279 C281: Supplier 1: Avnet; Supplier Part Number 1: CL31A106MBHNNNE
C157 C167 = CAP - 0402: Precision: 10%; Voltage: 16V; Value: 10nF; Current: *; CreatedBy: Jonathan Bouchard; Power: *; Package: 0402; Supplier 1: Arrow Electronics; Supplier Part Number 1: GRM155R61A224KE19D
C159 C268 C269 = CAP - 0201: Precision: 10%; Voltage: 16V; Value: 1nF; Current: *; CreatedBy: Jonathan Bouchard; Power: *; Package: 0201; Supplier 1: Avnet; Supplier Part Number 1: GRM033R71C102KA01J
C160 C270 C274 = CAP - 0201: Precision: 10%; Current: *; CreatedBy: Jonathan Bouchard; Power: *
  C160 C270: Supplier 1: Avnet; Supplier Part Number 1: GRM033R71C102KA01J
  C274: Supplier 1: Arrow Electronics; Supplier Part Number 1: GRM033R71C221KA01D
C161 C166 C169 C284 = CAP - 0603: Precision: 10%; Current: *; CreatedBy: Jonathan Bouchard; Power: *; Supplier 1: Arrow Electronics
  C161 C166: Package: 0603; Supplier Part Number 1: CL10B104KO8NNNC
  C169: Package: 0603; Supplier Part Number 1: CL10B105MO8NNWC
  C284: Supplier Part Number 1: GRM188R61H225KE11D
C170 C172 C173 = CAP - 0805: Precision: 10%; Voltage: 50V; Value: 10uF; Current: *; CreatedBy: Jonathan Bouchard; Power: *; Package: 0805; Supplier 1: Avnet; Supplier Part Number 1: CL31A106MBHNNNE
C171 C174 = CAP - 0805: Precision: 10%; Current: *; CreatedBy: Jonathan Bouchard; Power: *; Package: 0805; Supplier 1: Avnet; Supplier Part Number 1: CL31A106MBHNNNE
C246 C248 C249 C256 C258 C260 C262 C264 C266 = CAP_ALU_MAL215099101E3: CAP - ALU 100uF 20% 50V - 1010; Current: 490mA; Mfg: Vishay Dale; Mfg Part Number: MAL215099101E3; HelpURL: http://www.vishay.com/docs/28395/150crz.pdf; CreatedBy: Jonathan Bouchard; Temperature: -55°C to 125°C; Power: *; Supplier 1: Digikey; Supplier Part Number 1: 4399PHDKR-ND
C247 C254 C255 C257 C259 C261 C263 C265 C267 C276 C278 C280 C282 C286 = CAP - 1210: Precision: 10%; Current: *; CreatedBy: Jonathan Bouchard; Power: *; Supplier 1: Arrow Electronics; Supplier Part Number 1: CL32A476KOJNNNE
C250 = CAP - 1206: Precision: 10%; Voltage: 50V; Value: 10uF; Current: *; CreatedBy: Jonathan Bouchard; Power: *; Package: 1206; Supplier 1: Avnet; Supplier Part Number 1: CL31A106MBHNNNE
C252 = CAP_ALU_MAL214699501E3: CAP - ALU 330uF 20% 16V - 1010; Current: 750mA; Mfg: Vishay Dale; Mfg Part Number: MAL214699501E3; HelpURL: http://www.vishay.com/docs/28403/146cti.pdf; CreatedBy: Jonathan Bouchard; Temperature: -55°C to 125°C; Power: *; Supplier 1: Digikey; Supplier Part Number 1: 4405PHCT-ND
C253 C285 = CAP - 1210: Precision: 10%; Voltage: 16V; Value: 47uF; Current: *; CreatedBy: Jonathan Bouchard; Power: *; Package: 1210; Supplier 1: Arrow Electronics; Supplier Part Number 1: CL32A476KOJNNNE
C271-C273 = CAP - 0201: Precision: 10%; Voltage: 16V; Value: 220pF; Current: *; CreatedBy: Jonathan Bouchard; Power: *; Package: 0201; Supplier 1: Arrow Electronics; Supplier Part Number 1: GRM033R71C221KA01D
C283 = CAP - 0603: Precision: 10%; Voltage: 50V; Value: 2.2uF; Current: *; CreatedBy: Jonathan Bouchard; Power: *; Package: 0603; Supplier 1: Arrow Electronics; Supplier Part Number 1: GRM188R61H225KE11D
D31-D40 = LED_SML-311UTT86: LED - 620nM RED 2mA - 0603; Voltage: 1.8V; Mfg: ROHM Semiconductor; Power: 44mW; Current: 2mA; HelpURL: http://media.digikey.com/pdf/Data%20Sheets/Rohm%20PDFs/SML-311%20Series.pdf; CreatedBy: Jonathan Bouchard; Temperature: -30°C to 85°C; Package: 0603; Precision: *; Mfg Part Number: SML-311UTT86; Supplier 1: Digikey; Supplier Part Number 1: 511-1304-1-ND
L1 L2 = FER - 0805: Mfg: TDK Corporation; Current: 2.5A; Value: 50mR@0Hz / 330R@100MHz; Voltage: *; CreatedBy: Jonathan Bouchard; Power: *; Precision: *; Package: 0805; Supplier 1: Arrow Electronics; Supplier Part Number 1: MPZ2012S331AT000
Q7-Q16 = MOS_N_CHANNEL: N-Channel  Enhancement Mode Field Effect Transistor; Mfr: *; Package / Case: *; Vds: *; Rds ON: *; Vgs: *; Operating Temperature: *; Supplier 1: Avnet; Supplier Part Number 1: BSH103,215
R230-R253 = RES - 0603: Current: *; CreatedBy: Jonathan Bouchard; Supplier 1: Arrow Electronics
  R230-R237 R246 R248: Supplier Part Number 1: RMCF0603FT750R
  R238-R245 R250 R251: Supplier Part Number 1: RMCF0603FT100R
  R247 R249: Supplier Part Number 1: RMCF0603FT59K0
  R252 R253: Supplier Part Number 1: RMCF0603FT10K0

## Sheet S7CAS-PLEIADES-CARTE-MERE_Pxx_MECANICAL.SchDoc
size Tabloid; SheetNumber: 17; SheetTotal: 18; Sheet_Name: MECANICAL; Size: 11x17
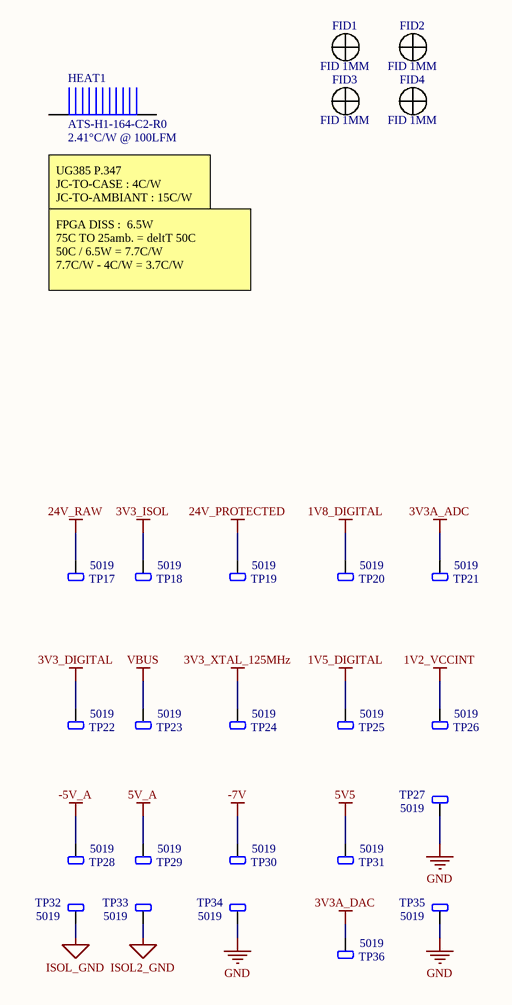
[diagram p15: S7CAS-PLEIADES-CARTE-MERE_Pxx_MECANICAL.SchDoc]

### Parts
FID1  FID 1MM  [FID_CIRCLE_1MM - PASTE_MASK]
FID2  FID 1MM  [FID_CIRCLE_1MM - PASTE_MASK]
FID3  FID 1MM  [FID_CIRCLE_1MM - PASTE_MASK]
FID4  FID 1MM  [FID_CIRCLE_1MM - PASTE_MASK]
HEAT1  ATS-H1-164-C2-R0  Thermal Resistance: 2.41°C/W @ 100LFM  [ATS-H1-164-C2-R0]
TP17  5019  [TPO_SMD_5019]
TP18  5019  [TPO_SMD_5019]
TP19  5019  [TPO_SMD_5019]
TP20  5019  [TPO_SMD_5019]
TP21  5019  [TPO_SMD_5019]
TP22  5019  [TPO_SMD_5019]
TP23  5019  [TPO_SMD_5019]
TP24  5019  [TPO_SMD_5019]
TP25  5019  [TPO_SMD_5019]
TP26  5019  [TPO_SMD_5019]
TP27  5019  [TPO_SMD_5019]
TP28  5019  [TPO_SMD_5019]
TP29  5019  [TPO_SMD_5019]
TP30  5019  [TPO_SMD_5019]
TP31  5019  [TPO_SMD_5019]
TP32  5019  [TPO_SMD_5019]
TP33  5019  [TPO_SMD_5019]
TP34  5019  [TPO_SMD_5019]
TP35  5019  [TPO_SMD_5019]
TP36  5019  [TPO_SMD_5019]

### Nets
1V2_VCCINT: TP26.1
1V5_DIGITAL: TP25.1
1V8_DIGITAL: TP20.1
3V3_DIGITAL: TP22.1
3v3_ISOL: TP18.1
3V3_XTAL_125MHz: TP24.1
3V3A_ADC: TP21.1
3V3A_DAC: TP36.1
5V5: TP31.1
5V_A: TP29.1
24V_PROTECTED: TP19.1
24V_RAW: TP17.1
-5V_A: TP28.1
-7V: TP30.1
GND: TP27.1 TP34.1 TP35.1  [project net nCS]
ISOL2_GND: TP33.1
ISOL_GND: TP32.1
VBUS: TP23.1

Not connected (* = marked no-connect by the designer): FID1 1 2; FID2 1 2; FID3 1 2; FID4 1 2; HEAT1 1 2

### Notes on the sheet
- (near HEAT1) UG385 P.347
  JC-TO-CASE : 4C/W
  JC-TO-AMBIANT : 15C/W
- FPGA DISS :  6.5W
  75C TO 25amb. = deltT 50C
  50C / 6.5W = 7.7C/W
  7.7C/W - 4C/W = 3.7C/W
- Sheet Name
- Project Title
- Global Project
- Size
- Group
- Revision
- Date
- Sheet
- of
- Filename
- Designers

### Library data of the parts
FID1-FID4 = FID_CIRCLE_1MM_PASTE_MASK: FID - FIDUCIAL 1MM CIRCLE DOUBLE-SIDED - 1MM; GRAMS Lib Spec: 2.8; Magnetic Material: NO; Cryo: UNKNOWN; Value: *; Tolerance: *; Voltage Rating: *; Current Rating: *; Power Max: *; HelpURL: https://www.pcb-3d.com/wordpress/wp-content/uploads/ipc-sm-782a_amendment_1_and_2.pdf; CreatedBy/Date: Jonathan Bouchard 2018-07-23; VerifiedBy: Caroline Paulin - 25 juillet 2018; Temperature: *; Package: 1MM CIRCLE; Manufacturer #1: *; Manufacturer #2: *; Note: *; Assembly Type: NONE; Part Number #2: *; Part Number #1: *; Polarized: *; Supplier 1: *; Supplier Part Number 1: *
HEAT1 = HEATSINK_ATS-H1-164-C2-R0: Heatsink Aluminium; Mfr: Advanced Thermal Solutions Inc.; Hole Size: 3mm; Hole-to-hole: 70.71mm; Fin Height: 35mm; Length: 45mm; Width: 45mm; Material: Aluminium; ComponentLink1Description: Digikey; ComponentLink1URL: https://www.digikey.com/en/products/detail/advanced-thermal-solutions-inc/ATS-H1-164-C2-R0/4624459; Supplier 1: Digikey; Supplier Part Number 1: ATS36354-ND; ComponentLink2Description: Mfr; ComponentLink2URL: https://www.qats.com/Online-PushPin/ATS-H1-164-C2-R0
TP17-TP36 = TPO_SMD_5019: TPO - PC TEST POINT MINI - SMD; Manufacturer #1: Keystone Electronics; Value: 3.81mm x 2.03mm; Polarized: No; Magnetic Material: UNKNOWN; GRAMS Lib Spec: 2.8; Current Rating: *; Manufacturer #2: *; Note: *; Power Max: *; Part Number #2: *; HelpURL: https://www.digikey.ca/product-detail/en/keystone-electronics/5019/36-5019CT-ND/3907344; Supplier 1: Digi-Key; Supplier Part Number 1: 36-5019CT-ND; Assembly Type: SMD; Part Number #1: 5019; Package: SMD; CreatedBy/Date: Olivier Bernard / 5/12/2017; Temperature: *; Tolerance: *; VerifiedBy: Caroline Paulin / 5 juillet 2018; Voltage Rating: *; Cryo: UNKNOWN